# EasyEDA Pro project ProProject_fpga_cpu_2024-09-28.epro, board PCB2
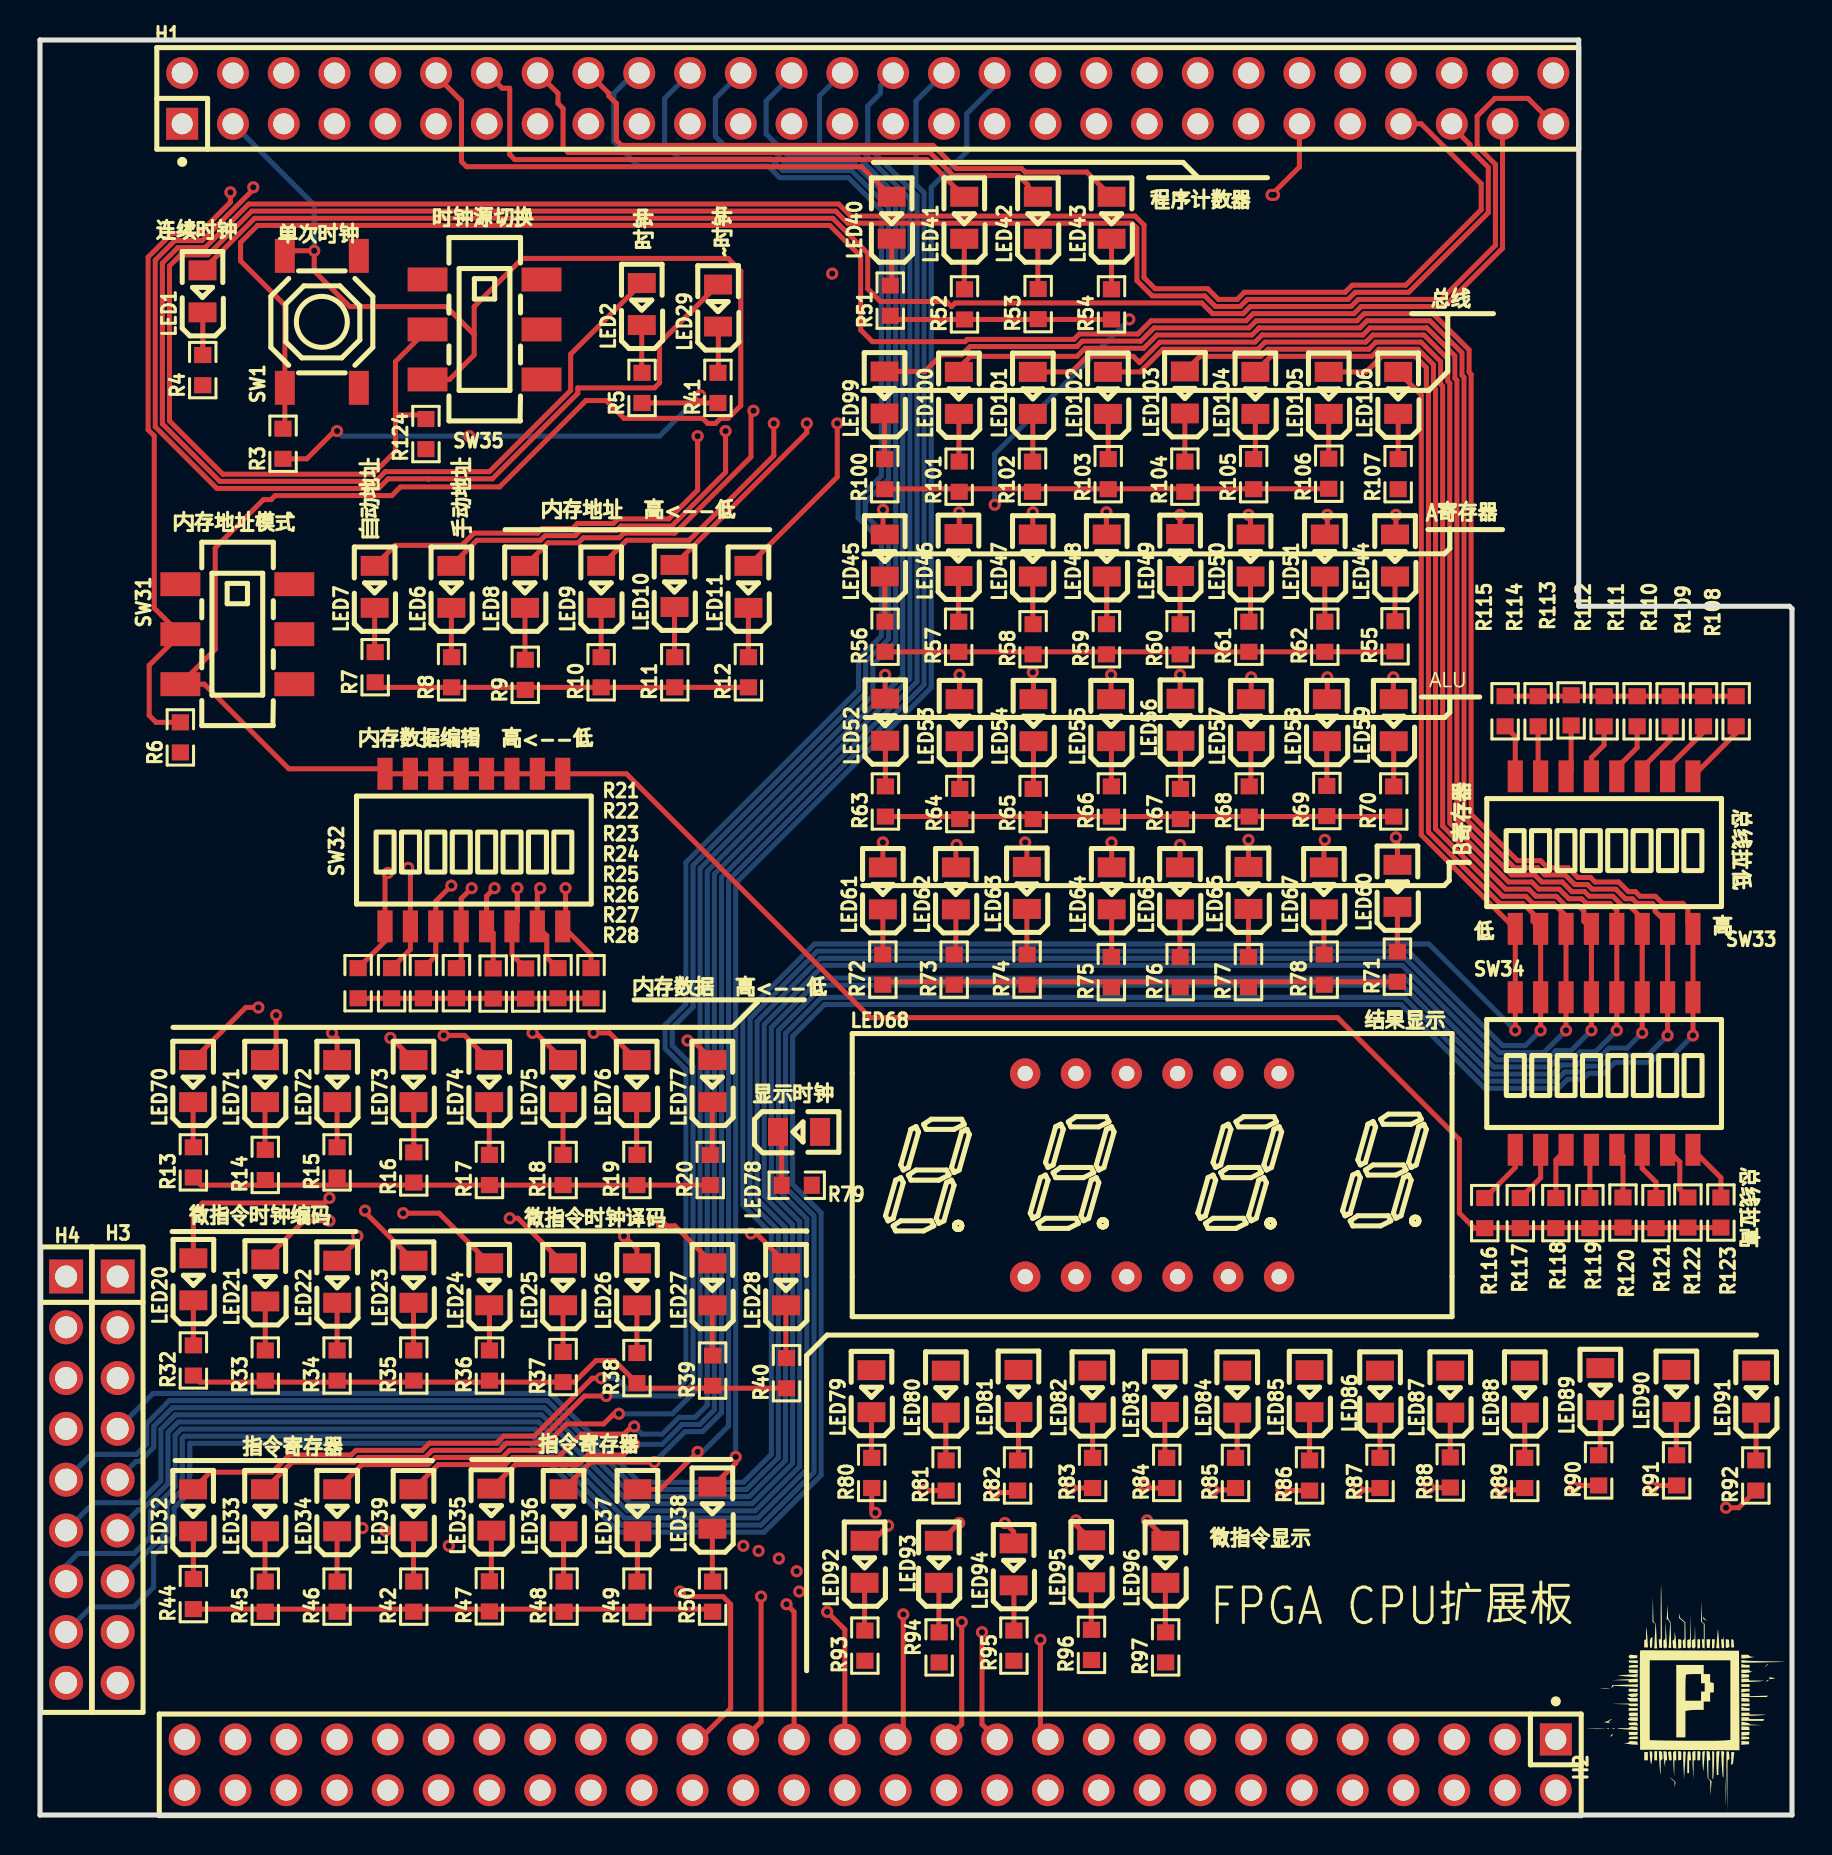
[diagram p5: board, top side]
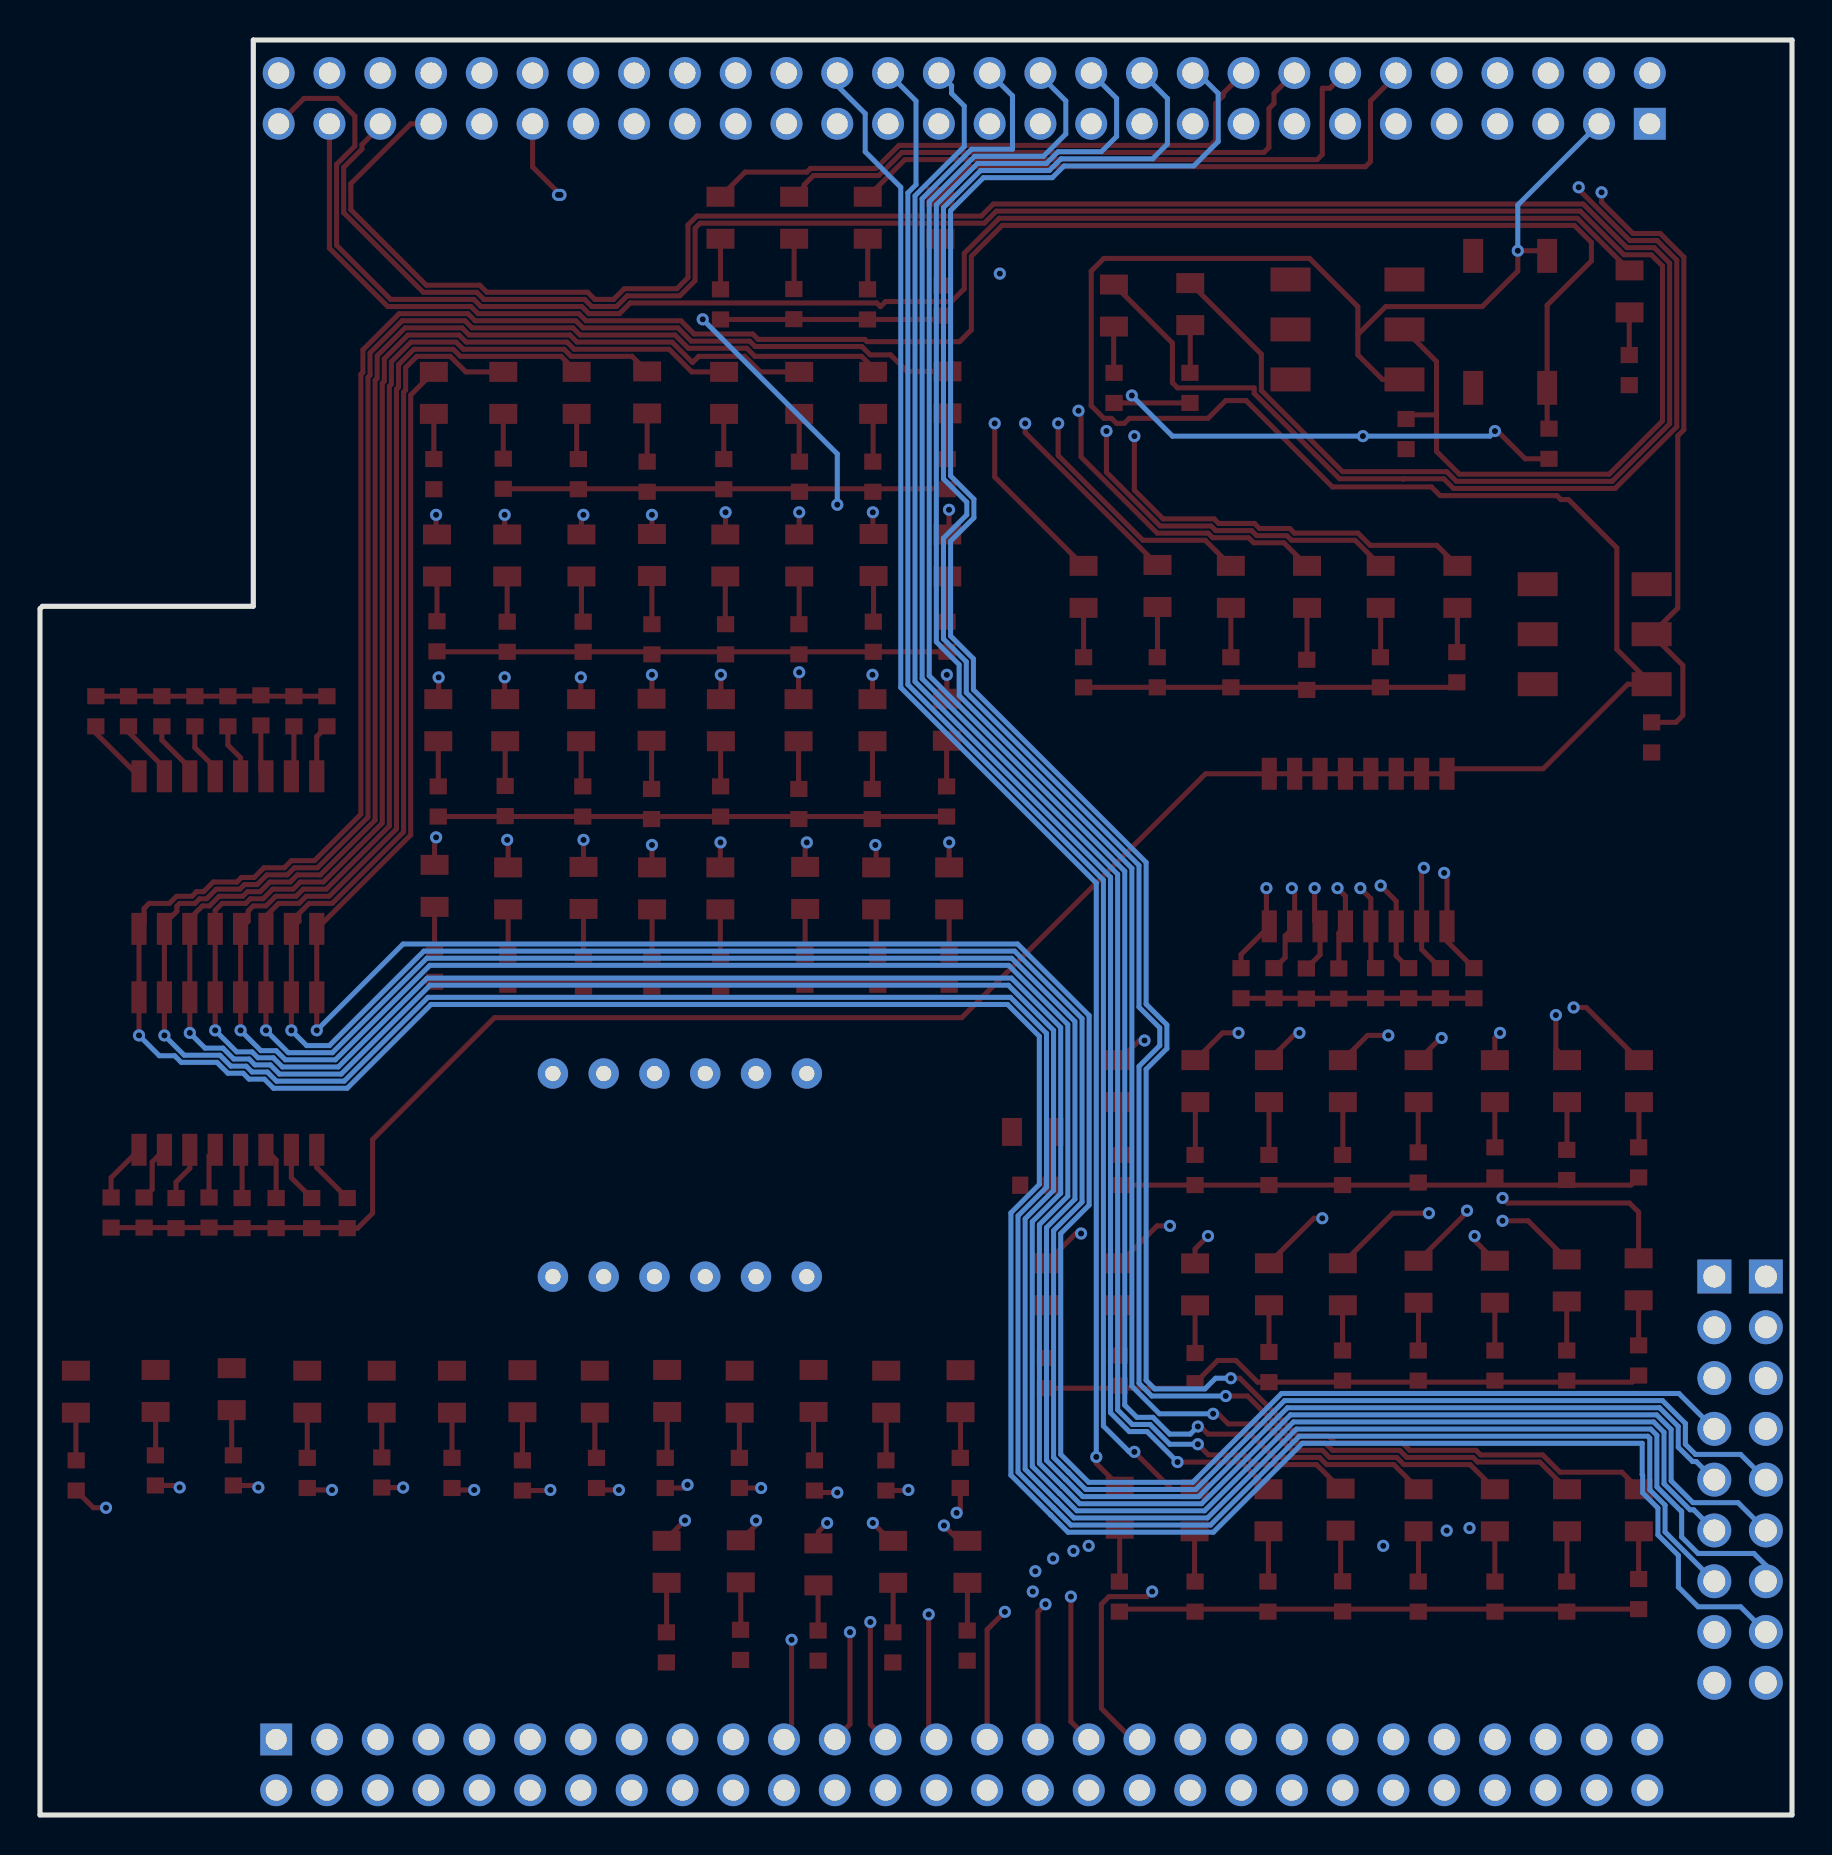
[diagram p6: board, bottom side, seen from below]

Outline 87.63 x 88.77 mm; copper layers: Top Layer, Inner1, Inner2, Bottom Layer. Coordinates in mm from the lower left corner of the outline.
Outline path: 0,88.77 76.96,88.77 76.96,60.45 87.5,60.45 87.63,60.33 87.63,0 0,0 0,88.77
Stack: Top Layer 0.035mm 外层铜厚1oz / Dielectric1 0.2104mm 7628 RC49% 8.6mil / Inner1 0.0152mm 内层铜厚 / Dielectric2 1.065mm 1.1mm H/HOZ 含铜 / Inner2 0.0152mm 内层铜厚 / Dielectric3 0.2104mm 7628 RC49% 8.6mil / Bottom Layer 0.035mm 外层铜厚1oz

## Design rules (mm)
template: JLCPCB Capability(Two Layers Board)
spacing copperThickness1oz (default): track to track 0.102, other pairs 0.152 to 0.3
spacing copperThickness2oz: track to track 0.203, other pairs 0.152 to 0.3
track width copperThickness1oz (default): min 0.127, default 0.254, max 2.54
track width copperThickness2oz: min 0.203, default 0.254, max 2.54
differential pair differentialPair (default): width min 0.127, default 0.254, max 2.54; gap min 0.152, default 0.152
via viaSize (default): diameter min 0.5, default 0.61, max 10; hole min 0.3, default 0.305, max 6.3

## Placement (name value [footprint] x y rotation side)
H1  X6521WV-2x28H-C60D30  [HDR-TH_56P-2.54-V-M-R2-C28-S2.54]  41.4 85.85 0 top
H2  X6521WV-2x28H-C60D30  [HDR-TH_56P-2.54-V-M-R2-C28-S2.54]  41.53 2.51 180 top
H3  -  [HDR-TH_9P-P2.54-V-M]  3.88 16.77 270 top
H4  -  [HDR-TH_9P-P2.54-V-M]  1.31 16.77 270 top
LED1  KT-0805Y  [LED0805-R-RD]  8.13 76.2 90 top
LED2  KT-0805Y  [LED0805-R-RD]  30.1 75.57 90 top
LED6  KT-0805Y  [LED0805-R-RD]  20.57 61.42 90 top
LED7  KT-0805G  [LED0805-R-RD]  16.74 61.42 90 top
LED8  KT-0805Y  [LED0805-R-RD]  24.26 61.42 90 top
LED9  KT-0805Y  [LED0805-R-RD]  28.07 61.42 90 top
LED10  KT-0805Y  [LED0805-R-RD]  31.74 61.47 90 top
LED11  KT-0805Y  [LED0805-R-RD]  35.43 61.42 90 top
LED20  KT-0805Y  [LED0805-R-RD]  7.67 26.79 90 top
LED21  KT-0805Y  [LED0805-R-RD]  11.27 26.73 90 top
LED22  KT-0805Y  [LED0805-R-RD]  14.86 26.67 90 top
LED23  KT-0805G  [LED0805-R-RD]  18.68 26.67 90 top
LED24  KT-0805G  [LED0805-R-RD]  22.47 26.54 90 top
LED25  KT-0805G  [LED0805-R-RD]  26.16 26.54 90 top
LED26  KT-0805G  [LED0805-R-RD]  29.86 26.54 90 top
LED27  KT-0805G  [LED0805-R-RD]  33.63 26.54 90 top
LED28  KT-0805G  [LED0805-R-RD]  37.31 26.54 90 top
LED29  KT-0805Y  [LED0805-R-RD]  33.91 75.49 90 top
LED32  KT-0805G  [LED0805-R-RD]  7.66 15.24 90 top
LED33  KT-0805G  [LED0805-R-RD]  11.25 15.24 90 top
LED34  KT-0805G  [LED0805-R-RD]  14.86 15.24 90 top
LED35  KT-0805Y  [LED0805-R-RD]  22.58 15.27 90 top
LED36  KT-0805Y  [LED0805-R-RD]  26.19 15.24 90 top
LED37  KT-0805Y  [LED0805-R-RD]  29.88 15.24 90 top
LED38  KT-0805Y  [LED0805-R-RD]  33.63 15.37 90 top
LED39  KT-0805G  [LED0805-R-RD]  18.68 15.24 90 top
LED40  KT-0805G  [LED0805-R-RD]  42.6 79.88 90 top
LED41  KT-0805G  [LED0805-R-RD]  46.23 79.88 90 top
LED42  KT-0805G  [LED0805-R-RD]  49.91 79.88 90 top
LED43  KT-0805G  [LED0805-R-RD]  53.59 79.88 90 top
LED44  KT-0805W  [LED0805-R-RD]  67.77 62.99 90 top
LED45  KT-0805W  [LED0805-R-RD]  42.25 62.99 90 top
LED46  KT-0805W  [LED0805-R-RD]  45.94 63.02 90 top
LED47  KT-0805W  [LED0805-R-RD]  49.66 62.99 90 top
LED48  KT-0805W  [LED0805-R-RD]  53.35 62.99 90 top
LED49  KT-0805W  [LED0805-R-RD]  57.02 63.02 90 top
LED50  KT-0805W  [LED0805-R-RD]  60.55 62.99 90 top
LED51  KT-0805W  [LED0805-R-RD]  64.26 62.99 90 top
LED52  KT-0805G  [LED0805-R-RD]  42.27 54.78 90 top
LED53  KT-0805G  [LED0805-R-RD]  45.99 54.75 90 top
LED54  KT-0805G  [LED0805-R-RD]  49.69 54.75 90 top
LED55  KT-0805G  [LED0805-R-RD]  53.57 54.75 90 top
LED56  KT-0805G  [LED0805-R-RD]  57.04 54.78 90 top
LED57  KT-0805G  [LED0805-R-RD]  60.57 54.75 90 top
LED58  KT-0805G  [LED0805-R-RD]  64.36 54.75 90 top
LED59  KT-0805G  [LED0805-R-RD]  67.71 54.75 90 top
LED60  KT-0805W  [LED0805-R-RD]  67.89 46.47 90 top
LED61  KT-0805W  [LED0805-R-RD]  42.16 46.34 90 top
LED62  KT-0805W  [LED0805-R-RD]  45.81 46.34 90 top
LED63  KT-0805W  [LED0805-R-RD]  49.36 46.37 90 top
LED64  KT-0805W  [LED0805-R-RD]  53.6 46.34 90 top
LED65  KT-0805W  [LED0805-R-RD]  57.02 46.34 90 top
LED66  KT-0805W  [LED0805-R-RD]  60.44 46.37 90 top
LED67  KT-0805W  [LED0805-R-RD]  64.22 46.34 90 top
LED68  FJ3461AH  [LED-SEG-TH_12P-L30.0-W14.0-P2.54-S10.16-BL]  55.63 32 0 top
LED70  NCD0805R1  [LED0805-R-RD]  7.66 36.7 90 top
LED71  NCD0805R1  [LED0805-R-RD]  11.25 36.7 90 top
LED72  NCD0805R1  [LED0805-R-RD]  14.86 36.7 90 top
LED73  NCD0805R1  [LED0805-R-RD]  18.68 36.7 90 top
LED74  NCD0805R1  [LED0805-R-RD]  22.47 36.7 90 top
LED75  NCD0805R1  [LED0805-R-RD]  26.16 36.7 90 top
LED76  NCD0805R1  [LED0805-R-RD]  29.84 36.7 90 top
LED77  NCD0805R1  [LED0805-R-RD]  33.63 36.7 90 top
LED78  NCD0805R1  [LED0805-R-RD]  37.96 34.16 0 top
LED79  KT-0805G  [LED0805-R-RD]  41.59 21.2 90 top
LED80  KT-0805G  [LED0805-R-RD]  45.31 21.17 90 top
LED81  KT-0805G  [LED0805-R-RD]  48.94 21.21 90 top
LED82  KT-0805G  [LED0805-R-RD]  52.63 21.17 90 top
LED83  KT-0805G  [LED0805-R-RD]  56.26 21.21 90 top
LED84  KT-0805G  [LED0805-R-RD]  59.88 21.17 90 top
LED85  KT-0805G  [LED0805-R-RD]  63.5 21.2 90 top
LED86  KT-0805G  [LED0805-R-RD]  67.02 21.17 90 top
LED87  KT-0805G  [LED0805-R-RD]  70.54 21.17 90 top
LED88  KT-0805G  [LED0805-R-RD]  74.26 21.17 90 top
LED89  KT-0805G  [LED0805-R-RD]  78.04 21.3 90 top
LED90  KT-0805G  [LED0805-R-RD]  81.84 21.21 90 top
LED91  KT-0805G  [LED0805-R-RD]  85.83 21.17 90 top
LED92  KT-0805G  [LED0805-R-RD]  41.24 12.66 90 top
LED93  KT-0805G  [LED0805-R-RD]  44.96 12.66 90 top
LED94  KT-0805G  [LED0805-R-RD]  48.7 12.54 90 top
LED95  KT-0805G  [LED0805-R-RD]  52.58 12.69 90 top
LED96  KT-0805G  [LED0805-R-RD]  56.29 12.66 90 top
LED99  KT-0805Y  [LED0805-R-RD]  42.24 71.15 90 top
LED100  KT-0805Y  [LED0805-R-RD]  45.96 71.12 90 top
LED101  KT-0805Y  [LED0805-R-RD]  49.66 71.12 90 top
LED102  KT-0805Y  [LED0805-R-RD]  53.41 71.12 90 top
LED103  KT-0805Y  [LED0805-R-RD]  57.26 71.15 90 top
LED104  KT-0805Y  [LED0805-R-RD]  60.79 71.12 90 top
LED105  KT-0805Y  [LED0805-R-RD]  64.46 71.12 90 top
LED106  KT-0805Y  [LED0805-R-RD]  67.93 71.12 90 top
R3  1kΩ  [R0603]  12.16 68.58 90 top
R4  330Ω  [R0603]  8.14 72.26 90 top
R5  330Ω  [R0603]  30.11 71.37 90 top
R6  1kΩ  [R0603]  7.02 53.89 90 top
R7  330Ω  [R0603]  16.76 57.4 90 top
R8  330Ω  [R0603]  20.59 57.15 90 top
R9  330Ω  [R0603]  24.27 57.02 90 top
R10  330Ω  [R0603]  28.07 57.15 90 top
R11  330Ω  [R0603]  31.75 57.15 90 top
R12  330Ω  [R0603]  35.43 57.15 90 top
R13  330Ω  [R0603]  7.67 32.64 90 top
R14  330Ω  [R0603]  11.27 32.51 90 top
R15  330Ω  [R0603]  14.86 32.64 90 top
R16  330Ω  [R0603]  18.7 32.39 90 top
R17  330Ω  [R0603]  22.48 32.26 90 top
R18  330Ω  [R0603]  26.16 32.26 90 top
R19  330Ω  [R0603]  29.86 32.26 90 top
R20  330Ω  [R0603]  33.52 32.26 90 top
R21  1kΩ  [R0603]  15.91 41.6 90 top
R22  1kΩ  [R0603]  17.59 41.6 90 top
R23  1kΩ  [R0603]  19.18 41.6 90 top
R24  1kΩ  [R0603]  20.83 41.6 90 top
R25  1kΩ  [R0603]  22.67 41.58 90 top
R26  1kΩ  [R0603]  24.29 41.58 90 top
R27  1kΩ  [R0603]  25.91 41.6 90 top
R28  1kΩ  [R0603]  27.56 41.6 90 top
R32  330Ω  [R0603]  7.67 22.73 90 top
R33  330Ω  [R0603]  11.27 22.48 90 top
R34  330Ω  [R0603]  14.86 22.48 90 top
R35  330Ω  [R0603]  18.7 22.48 90 top
R36  330Ω  [R0603]  22.48 22.48 90 top
R37  330Ω  [R0603]  26.16 22.4 90 top
R38  330Ω  [R0603]  29.86 22.35 90 top
R39  330Ω  [R0603]  33.64 22.23 90 top
R40  330Ω  [R0603]  37.34 22.1 90 top
R41  330Ω  [R0603]  33.91 71.37 90 top
R42  330Ω  [R0603]  18.7 10.92 90 top
R44  330Ω  [R0603]  7.67 11.05 90 top
R45  330Ω  [R0603]  11.27 10.92 90 top
R46  330Ω  [R0603]  14.86 10.92 90 top
R47  330Ω  [R0603]  22.48 10.94 90 top
R48  330Ω  [R0603]  26.21 10.92 90 top
R49  330Ω  [R0603]  29.86 10.92 90 top
R50  330Ω  [R0603]  33.64 10.92 90 top
R51  330Ω  [R0603]  42.53 75.74 90 top
R52  330Ω  [R0603]  46.24 75.55 90 top
R53  330Ω  [R0603]  49.92 75.57 90 top
R54  330Ω  [R0603]  53.59 75.55 90 top
R55  330Ω  [R0603]  67.77 58.95 90 top
R56  330Ω  [R0603]  42.27 58.93 90 top
R57  330Ω  [R0603]  45.95 58.93 90 top
R58  330Ω  [R0603]  49.67 58.8 90 top
R59  330Ω  [R0603]  53.34 58.8 90 top
R60  330Ω  [R0603]  57.02 58.8 90 top
R61  330Ω  [R0603]  60.46 58.93 90 top
R62  330Ω  [R0603]  64.26 58.93 90 top
R63  330Ω  [R0603]  42.28 50.69 90 top
R64  330Ω  [R0603]  46.01 50.56 90 top
R65  330Ω  [R0603]  49.67 50.56 90 top
R66  330Ω  [R0603]  53.59 50.69 90 top
R67  330Ω  [R0603]  57.04 50.56 90 top
R68  330Ω  [R0603]  60.48 50.69 90 top
R69  330Ω  [R0603]  64.36 50.71 90 top
R70  330Ω  [R0603]  67.71 50.69 90 top
R71  330Ω  [R0603]  67.89 42.43 90 top
R72  330Ω  [R0603]  42.16 42.28 90 top
R73  330Ω  [R0603]  45.72 42.28 90 top
R74  330Ω  [R0603]  49.37 42.28 90 top
R75  330Ω  [R0603]  53.59 42.15 90 top
R76  330Ω  [R0603]  57.03 42.15 90 top
R77  330Ω  [R0603]  60.44 42.15 90 top
R78  330Ω  [R0603]  64.23 42.28 90 top
R79  330Ω  [R0603]  37.85 31.5 180 top
R80  330Ω  [R0603]  41.6 17.11 90 top
R81  330Ω  [R0603]  45.32 16.98 90 top
R82  330Ω  [R0603]  48.89 16.98 90 top
R83  330Ω  [R0603]  52.65 17.11 90 top
R84  330Ω  [R0603]  56.36 17.11 90 top
R85  330Ω  [R0603]  59.8 17.11 90 top
R86  330Ω  [R0603]  63.5 16.98 90 top
R87  330Ω  [R0603]  67.02 17.11 90 top
R88  330Ω  [R0603]  70.54 17.13 90 top
R89  330Ω  [R0603]  74.26 17.11 90 top
R90  330Ω  [R0603]  77.96 17.24 90 top
R91  330Ω  [R0603]  81.86 17.24 90 top
R92  330Ω  [R0603]  85.82 16.98 90 top
R93  330Ω  [R0603]  41.26 8.47 90 top
R94  330Ω  [R0603]  44.97 8.38 90 top
R95  330Ω  [R0603]  48.71 8.47 90 top
R96  330Ω  [R0603]  52.59 8.51 90 top
R97  330Ω  [R0603]  56.3 8.38 90 top
R100  330Ω  [R0603]  42.25 67.06 90 top
R101  330Ω  [R0603]  45.97 66.93 90 top
R102  330Ω  [R0603]  49.64 66.93 90 top
R103  330Ω  [R0603]  53.43 67.06 90 top
R104  330Ω  [R0603]  57.26 66.93 90 top
R105  330Ω  [R0603]  60.7 67.06 90 top
R106  330Ω  [R0603]  64.46 67.08 90 top
R107  330Ω  [R0603]  67.93 67.06 90 top
R108  1kΩ  [R0603]  84.84 55.2 270 top
R109  1kΩ  [R0603]  83.2 55.2 270 top
R110  1kΩ  [R0603]  81.53 55.2 270 top
R111  1kΩ  [R0603]  79.88 55.2 270 top
R112  1kΩ  [R0603]  78.23 55.2 270 top
R113  1kΩ  [R0603]  76.58 55.25 270 top
R114  1kΩ  [R0603]  74.93 55.2 270 top
R115  1kΩ  [R0603]  73.28 55.2 270 top
R116  1kΩ  [R0603]  72.26 30.1 90 top
R117  1kΩ  [R0603]  74.04 30.1 90 top
R118  1kΩ  [R0603]  75.82 30.1 90 top
R119  1kΩ  [R0603]  77.52 30.1 90 top
R120  1kΩ  [R0603]  79.17 30.13 90 top
R121  1kΩ  [R0603]  80.83 30.1 90 top
R122  1kΩ  [R0603]  82.42 30.13 90 top
R123  1kΩ  [R0603]  84.07 30.13 90 top
R124  1kΩ  [R0603]  19.3 69.06 90 top
SW1  TS-1187A-B-A-B  [SW-SMD_4P-L5.1-W5.1-P3.70-LS6.5-TL-2]  14.1 74.68 90 top
SW31  MST22D18G2  [SW-SMD_MST22D18G2]  9.87 59.06 270 top
SW32  DSHP08TSGER  [SW-SMD_16P-L11.7-W5.4-P1.27-LS8.5]  21.7 48.26 0 top
SW33  DSHP08TSGER  [SW-SMD_16P-L11.7-W5.4-P1.27-LS8.5]  78.23 48.13 180 top
SW34  DSHP08TSGER  [SW-SMD_16P-L11.7-W5.4-P1.27-LS8.5]  78.23 37.08 0 top
SW35  MST22D18G2  [SW-SMD_MST22D18G2]  22.23 74.3 270 top

## Footprints (pads in the part's own frame, mm; a bottom-side part is the same pattern mirrored in y, then rotated)
HDR-TH_9P-P2.54-V-M
  rect 1.7x1.7 hole 1.1: 1(-10.16,0)
  round 1.7 hole 1.1: 2(-7.62,0) 3(-5.08,0) 4(-2.54,0) 5(0,0) 6(2.54,0) 7(5.08,0) 8(7.62,0) 9(10.16,0)
HDR-TH_56P-2.54-V-M-R2-C28-S2.54
  rect 1.6x1.6 hole 1.05: 1(-34.29,-1.27)
  round 1.6 hole 1.05: 2(-34.29,1.27) 3(-31.75,-1.27) 4(-31.75,1.27) 5(-29.21,-1.27) 6(-29.21,1.27) 7(-26.67,-1.27) 8(-26.67,1.27) 9(-24.13,-1.27) 10(-24.13,1.27) 11(-21.59,-1.27) 12(-21.59,1.27) 13(-19.05,-1.27) 14(-19.05,1.27) 15(-16.51,-1.27) 16(-16.51,1.27) 17(-13.97,-1.27) 18(-13.97,1.27) 19(-11.43,-1.27) 20(-11.43,1.27) 21(-8.89,-1.27) 22(-8.89,1.27) 23(-6.35,-1.27) 24(-6.35,1.27) 25(-3.81,-1.27) 26(-3.81,1.27) 27(-1.27,-1.27) 28(-1.27,1.27) 29(1.27,-1.27) 30(1.27,1.27) 31(3.81,-1.27) 32(3.81,1.27) 33(6.35,-1.27) 34(6.35,1.27) 35(8.89,-1.27) 36(8.89,1.27) 37(11.43,-1.27) 38(11.43,1.27) 39(13.97,-1.27) 40(13.97,1.27) 41(16.51,-1.27) 42(16.51,1.27) 43(19.05,-1.27) 44(19.05,1.27) 45(21.59,-1.27) 46(21.59,1.27) 47(24.13,-1.27) 48(24.13,1.27) 49(26.67,-1.27) 50(26.67,1.27) 51(29.21,-1.27) 52(29.21,1.27) 53(31.75,-1.27) 54(31.75,1.27) 55(34.29,-1.27) 56(34.29,1.27)
LED0805-R-RD
  rect 1x1.399 smd: 1(1.05,0) 2(-1.05,0)
LED-SEG-TH_12P-L30.0-W14.0-P2.54-S10.16-BL
  round 1.524 hole 0.762: 1(-6.35,-5.08) 2(-3.81,-5.08) 3(-1.27,-5.08) 4(1.27,-5.08) 5(3.81,-5.08) 6(6.35,-5.08) 7(6.35,5.08) 8(3.81,5.08) 9(1.27,5.08) 10(-1.27,5.08) 11(-3.81,5.08) 12(-6.35,5.08)
R0603
  rect 0.806x0.864 smd: 1(-0.753,0) 2(0.753,0)
SW-SMD_4P-L5.1-W5.1-P3.70-LS6.5-TL-2
  rect 1.7x1 smd: 1(-3.3,1.85) 2(3.3,1.85) 3(-3.3,-1.85) 4(3.3,-1.85)
SW-SMD_16P-L11.7-W5.4-P1.27-LS8.5
  rect 0.76x1.6 smd: 1(-4.445,-3.815) 2(-3.175,-3.815) 3(-1.905,-3.815) 4(-0.635,-3.815) 5(0.635,-3.815) 6(1.905,-3.815) 7(3.175,-3.815) 8(4.445,-3.815) 9(-4.445,3.815) 10(-3.175,3.815) 11(-1.905,3.815) 12(-0.635,3.815) 13(0.635,3.815) 14(1.905,3.815) 15(3.175,3.815) 16(4.445,3.815)
SW-SMD_MST22D18G2
  rect 1.2x2 smd: 1(-2.5,2.85) 2(0,2.85) 3(2.5,2.85) 4(-2.5,-2.85) 5(0,-2.85) 6(2.5,-2.85)

## Nets
As in the schematic.

Pads without a net: H3 1 2 3 8 9; H4 1 2 3 4 9; SW1 3 4; SW31 1 2 3 4; SW35 1 2 3 4

## Via types
v1: diameter 0.61, hole 0.305, Top Layer to Bottom Layer, 116 vias

## Routing (per net, layer and track width the routed paths; a pad name or vN(x,y) marks a point on that pad's centre or on a via; arc(x,y) is an arc through that point)
+3.3V: length 174.7
  Top Layer w0.254: 21.72,74.04 21.72,75.44 24.13,77.85 34.42,77.85 35.05,77.22 35.05,70.49 34.42,69.85 34.04,69.85 33.78,69.6 33.4,69.6 33.15,69.85 29.21,69.85 28.32,70.74 27.31,70.74 22.99,66.42 18.03,66.42 17.6,65.99 11.76,65.99 11.56,65.79 11.18,65.79 8.76,63.37 8.76,58.3 SW31.6 8.21,56.56 12.45,52.32 17.01,52.32 SW32.9 SW32.10 SW32.11 SW32.12 SW32.13 SW32.14 SW32.15 SW32.16 29.33,52.08 41.53,39.88 64.9,39.88 70.99,33.78 70.99,30.1 71.74,29.35 R116.1 72.29,29.38 R120.1 R122.1 R123.1 ; 21.72,74.04 20.32,75.44 15.49,75.44 13.72,77.22 v1(13.72,78.23) 12.5,78.23 SW1.2 ; 21.72,74.04 21.72,73.03 20.49,71.8 SW35.6
  Bottom Layer w0.254: v1(13.72,78.23) 13.72,80.52 H1.3
GND: length 342.8
  Top Layer w0.254: R106.1 42.28,66.33 R100.1 ; v1(80.64,16.38) 80.74,16.48 R91.1 ; 33.93,70.49 33.8,70.62 R5.1 ; R28.1 R27.1 R24.1 R23.1 R22.1 R21.1 ; R3.1 13.34,67.83 14.73,69.22 v1(14.86,69.22) ; R20.1 R19.1 R18.1 R17.1 8.05,31.5 R13.1 ; v1(62.1,16.26) 62.13,16.23 R86.1 ; v1(76.71,16.38) 76.81,16.48 R90.1 ; 42.16,41.53 42.31,41.67 R71.1 ; R88.1 v1(69.47,16.38) ; R7.1 17.02,56.4 R8.1 R10.1 R11.1 R12.1 ; R87.1 66.92,16.26 v1(65.91,16.26) ; v1(41.78,15.11) 41.6,15.3 R80.1 ; v1(84.33,15.37) 84.96,15.37 R92.1 ; 53.59,74.8 42.71,74.8 R51.1 ; v1(47.75,16.13) 48.8,16.13 R82.1 ; R115.1 R114.1 R112.1 R111.1 R110.1 R109.1 R108.1 ; v1(58.67,16.26) 59.7,16.26 R85.1 ; v1(73.03,16.26) 74.16,16.26 R89.1 ; R56.1 R57.1 R61.1 R62.1 67.75,58.17 R55.1 ; R83.1 v1(51.56,16.36) ; R81.1 44.22,16.23 v1(44.2,16.26) ; v1(55.25,16.51) 55.4,16.36 R84.1 ; R63.1 R66.1 R68.1 R70.1 ; R32.1 8,21.65 R37.1 26.73,21.65 27.81,22.73 28.72,22.73 R38.1 30.11,21.34 R40.1 ; R44.1 33.52,10.3 R50.1
  Inner1 w0.254: v1(41.78,15.11) 42.04,15.37 47.78,15.37 ; 47.78,15.37 51.56,15.37 ; 47.78,15.37 47.75,15.39 v1(47.75,16.13) ; 51.56,15.37 55.25,15.37 ; 51.56,15.37 v1(51.56,16.36) ; 55.25,15.37 55.25,15.37 v1(55.25,16.51) ; 55.25,15.37 58.66,15.37 ; 80.55,15.37 80.64,15.46 v1(80.64,16.38) ; 80.55,15.37 v1(84.33,15.37) ; 80.55,15.37 76.71,15.37 ; v1(58.67,16.26) 58.67,15.38 58.66,15.37 ; v1(44.2,16.26) 44.2,15.37 ; 58.66,15.37 62.1,15.37 ; v1(73.03,16.26) 73.03,15.37 73.02,15.37 ; v1(76.71,16.38) 76.71,15.37 ; 76.71,15.37 73.02,15.37 ; v1(65.91,16.26) 65.79,16.13 65.79,15.37 ; 65.79,15.37 69.41,15.37 ; 65.79,15.37 62.1,15.37 ; 73.02,15.37 69.41,15.37 ; v1(69.47,16.38) 69.47,15.42 69.41,15.37 ; 62.1,15.37 v1(62.1,16.26)
  Bottom Layer w0.254: v1(47.75,65.53) 47.75,68.07 v1(54.48,74.8) ; v1(14.86,69.22) 15.11,68.96 v1(21.46,68.96) 30.99,68.96 v1(33.02,70.99)
AA8: length 189.1
  Top Layer w0.254: LED51.1 64.39,64.17 v1(64.39,65.02)
  Inner1 w0.254: 28.2,7.72 8.5,7.72 7.22,9.01 7.22,28.83 5.84,30.2 5.08,30.2 2.56,32.72 2.56,64.44 4.21,66.09 37.07,66.09 37.09,66.06 37.85,66.06 41.17,62.74 46.08,62.74 46.43,63.09 49.61,63.09 49.97,63.45 53.15,63.45 53.25,63.55 53.76,63.55 54.12,63.91 59.84,63.91 60.19,64.26 60.58,64.26 61.34,65.02 v1(64.39,65.02) ; 28.2,7.72 57.92,7.72 59.35,6.3 64.06,6.3 64.89,5.46 66.52,5.46 H2.7 ; 28.2,7.72 30.48,7.72
AA18: length 167.2
  Top Layer w0.254: LED60.1 67.89,48.82 v1(67.82,48.9)
  Inner1 w0.254: v1(67.82,48.9) 67.82,54.86 66.67,56.01 42.16,56.01 40.26,57.91 40.26,59.18 39.7,59.18 36.37,62.5 35.62,62.5 35.59,62.53 6.33,62.53 6.33,34.04 6.6,33.76 7.31,33.76 10.78,30.3 10.78,11.28 31.1,11.28 31.57,11.76 37.39,11.76 v1(37.97,11.18)
  Inner2 w0.254: H2.37 31.52,5.21 35.94,5.21 37.97,7.24 v1(37.97,11.18)
AB6: length 181.5
  Top Layer w0.254: LED50.1 60.55,64.93 v1(60.45,65.02)
  Inner1 w0.254: H2.9 65.15,4.29 65.15,4.7 63.91,5.94 59.2,5.94 57.77,7.37 8.35,7.37 6.86,8.86 6.86,28.68 5.69,29.85 4.93,29.85 2.21,32.57 2.21,64.59 4.06,66.44 37.22,66.44 37.24,66.42 37.99,66.42 41.32,63.09 45.93,63.09 46.28,63.45 49.46,63.45 49.82,63.8 53,63.8 53.1,63.91 53.61,63.91 53.97,64.26 59.69,64.26 v1(60.45,65.02)
AB7: length 176.2
  Top Layer w0.254: LED49.1 v1(57.02,65.02)
  Inner1 w0.254: v1(57.02,65.02) 54.23,65.02 53.47,64.26 52.95,64.26 52.85,64.16 49.67,64.16 49.32,63.8 46.14,63.8 45.78,63.45 41.47,63.45 38.14,66.78 37.39,66.78 37.36,66.8 3.92,66.8 1.85,64.73 1.85,32.42 4.78,29.49 5.54,29.49 6.5,28.53 6.5,8.72 8.21,7.01 57.63,7.01 59.05,5.59 61.6,5.59 63.12,4.07 H2.11
ALU_0: length 175.8
  Top Layer w0.254: 67.71,55.8 67.69,55.82 v1(67.69,56.9) ; v1(50.04,8.76) 50.04,4.16 H2.21
  Inner1 w0.254: v1(50.04,8.76) 49.71,8.44 8.8,8.44 7.93,9.3 7.93,29.12 6.13,30.92 5.37,30.92 3.27,33.01 3.27,64.14 4.51,65.38 36.77,65.38 36.8,65.35 37.55,65.35 40.88,62.02 46.37,62.02 46.73,62.38 49.91,62.38 50.26,62.74 53.44,62.74 53.54,62.84 54.06,62.84 54.41,63.19 60.13,63.19 60.49,63.55 60.87,63.55 60.95,63.63 v1(67.69,56.9)
ALU_1: length 168.5
  Top Layer w0.254: v1(64.39,56.9) 64.39,55.83 64.36,55.8 ; v1(47.12,9.14) 47.12,4.54 H2.23
  Inner1 w0.254: v1(47.12,9.14) 46.76,8.79 8.94,8.79 8.28,9.45 8.28,29.27 6.28,31.27 5.52,31.27 3.63,33.16 3.63,63.99 4.65,65.02 36.63,65.02 36.65,65 37.4,65 40.73,61.67 46.52,61.67 46.87,62.02 50.05,62.02 50.41,62.38 53.59,62.38 53.69,62.48 54.2,62.48 54.56,62.84 58.45,62.84 v1(64.39,56.9)
ALU_2: length 164.8
  Top Layer w0.254: v1(60.58,56.9) 60.58,55.82 60.57,55.8 ; v1(46.1,9.65) 46.1,4.55 H2.25
  Inner1 w0.254: v1(60.58,56.9) 60.58,60.2 58.3,62.48 54.71,62.48 54.35,62.13 53.84,62.13 53.74,62.02 50.56,62.02 50.2,61.67 47.02,61.67 46.67,61.31 40.58,61.31 37.26,64.64 36.5,64.64 36.48,64.66 4.8,64.66 3.98,63.85 3.98,33.31 5.67,31.63 6.43,31.63 8.64,29.41 8.64,9.6 9.09,9.15 45.47,9.15 45.97,9.65 v1(46.1,9.65)
ALU_3: length 156.8
  Top Layer w0.254: v1(43.18,10.03) 43.18,4.16 H2.27 ; v1(57.02,57.02) 57.02,55.85 LED56.1
  Inner1 w0.254: v1(43.18,10.03) 43.05,10.03 42.52,9.5 9.24,9.5 9,9.74 9,29.56 6.57,31.98 5.81,31.98 4.34,33.46 4.34,63.7 4.95,64.31 36.33,64.31 36.36,64.28 37.11,64.28 40.44,60.96 46.81,60.96 47.17,61.31 50.35,61.31 50.7,61.67 53.88,61.67 53.99,61.77 54.5,61.77 54.72,61.99 57.02,59.69 v1(57.02,57.02)
ALU_4: length 148.6
  Top Layer w0.254: H2.29 40.26,9.27 v1(39.37,10.16) ; 53.57,55.8 v1(53.57,57.02)
  Inner1 w0.254: v1(39.37,10.16) 39.07,9.86 9.38,9.86 9.35,9.89 9.35,29.71 6.72,32.34 6.02,32.34 4.69,33.66 4.69,63.44 5.21,63.95 36.18,63.95 36.21,63.93 36.96,63.93 40.29,60.6 46.96,60.6 47.32,60.96 50.5,60.96 50.85,61.31 52.73,61.31 53.57,60.47 v1(53.57,57.02)
ALU_5: length 140.4
  Top Layer w0.254: v1(37.34,10.54) 37.72,10.16 H2.31 ; 49.69,55.8 49.69,57.12 v1(49.66,57.15)
  Inner1 w0.254: v1(37.34,10.54) 37.01,10.22 9.97,10.22 9.72,10.47 9.72,10.73 9.71,10.74 9.71,29.86 6.87,32.7 6.16,32.7 5.08,33.78 5.08,63.21 5.47,63.6 36.04,63.6 36.06,63.57 36.81,63.57 40.14,60.24 47.11,60.24 47.46,60.6 48.75,60.6 49.66,59.69 v1(49.66,57.15)
ALU_6: length 134.1
  Top Layer w0.254: 45.99,55.8 v1(45.99,57.02) ; v1(36.07,10.92) 36.07,4.67 H2.33
  Inner1 w0.254: v1(45.99,57.02) 45.99,59.55 45.65,59.89 39.99,59.89 36.67,63.22 35.91,63.22 35.89,63.24 5.82,63.24 5.44,62.85 5.44,33.93 6.31,33.05 7.02,33.05 10.06,30 10.06,10.81 10.3,10.57 35.72,10.57 v1(36.07,10.92)
ALU_7: length 127.5
  Top Layer w0.254: v1(32,11.18) 32.26,10.92 34.16,10.92 34.54,10.54 34.54,5.33 32.99,3.78 H2.35 ; LED52.1 v1(42.27,57.02)
  Inner1 w0.254: v1(32,11.18) 31.76,10.93 10.45,10.93 10.42,10.95 10.42,30.15 7.16,33.41 6.46,33.41 5.97,33.89 5.97,62.88 35.74,62.88 35.77,62.86 36.52,62.86 39.85,59.53 41.69,59.53 42.27,58.95 v1(42.27,57.02)
BUS0: length 135.6
  Top Layer w0.254: v1(73.79,39.24) SW34.9 SW33.16 69.09,49.02 69.09,71.02 LED106.1
  Bottom Layer w0.254: v1(73.79,39.24) 69.47,43.56 38.73,43.56 35.15,39.98 35.15,30.51 36.58,29.08 36.58,18.03 35.18,16.64 29.97,16.64 25.53,21.08 5.66,21.08 H3.4
BUS1: length 147.8
  Top Layer w0.254: LED105.1 66.33,72.17 67.11,72.95 68.78,72.95 69.34,72.39 69.34,71.27 69.44,71.16 69.44,49.16 73.02,45.59 74.17,45.59 74.68,45.09 74.68,44.7 SW33.15 SW34.10 v1(75.06,39.24)
  Bottom Layer w0.254: H4.5 2.57,18.03 4.83,18.03 5.33,18.54 5.33,19.58 6.48,20.73 25.38,20.73 29.82,16.28 35.33,16.28 36.19,17.15 36.19,17.15 36.93,17.88 36.93,29.23 35.51,30.65 35.51,39.83 38.88,43.21 68.43,43.21 73.15,38.48 74.29,38.48 v1(75.06,39.24)
BUS2: length 151.8
  Top Layer w0.254: LED104.1 61.57,72.95 66.61,72.95 66.96,73.31 68.93,73.31 69.7,72.54 69.7,71.41 69.8,71.31 69.8,49.31 73.16,45.95 74.32,45.95 74.67,45.59 75.69,45.59 76.33,44.96 SW33.14 SW34.11 v1(76.33,39.24)
  Bottom Layer w0.254: v1(76.33,39.24) 75.21,38.13 73,38.13 68.28,42.85 39.03,42.85 35.87,39.69 35.87,30.8 37.29,29.38 37.29,17.73 36.34,16.79 36.34,16.79 35.47,15.93 29.68,15.93 25.23,20.37 6.62,20.37 5.69,19.44 5.69,18.39 4.97,17.68 4.79,17.68 H3.5
BUS3: length 162.6
  Top Layer w0.254: v1(77.6,39.24) SW34.12 SW33.13 77.22,44.7 77.22,45.21 76.96,45.47 76.32,45.47 75.84,45.95 74.82,45.95 74.46,46.31 73.31,46.31 70.16,49.46 70.16,71.46 70.05,71.56 70.05,72.69 69.07,73.66 66.82,73.66 66.46,73.31 61.42,73.31 61.06,72.95 58.02,72.95 LED103.1
  Bottom Layer w0.254: v1(77.6,39.24) 76.58,38.23 75.81,38.23 75.36,37.77 72.86,37.77 68.13,42.49 39.18,42.49 36.22,39.54 36.22,30.95 37.64,29.53 37.64,17.59 36.49,16.43 36.49,16.43 35.62,15.57 29.53,15.57 25.08,20.01 6.77,20.01 6.05,19.29 6.05,16.71 4.95,15.62 2.7,15.62 H4.6
BUS4: length 166.8
  Top Layer w0.254: v1(78.87,39.24) SW34.13 SW33.12 78.87,45.25 78.52,45.59 77.34,45.59 77.11,45.82 76.47,45.82 75.99,46.31 74.97,46.31 74.61,46.66 73.46,46.66 70.51,49.61 70.51,71.61 70.41,71.71 70.41,72.83 69.22,74.02 66.67,74.02 66.31,73.66 61.27,73.66 60.92,73.31 56.16,73.31 55.03,72.17 LED102.1
  Bottom Layer w0.254: v1(78.87,39.24) 77.79,38.17 77.02,38.17 76.73,37.87 75.96,37.87 75.5,37.41 72.71,37.41 68.27,41.86 39.04,41.86 36.58,39.39 36.58,31.1 38,29.67 38,17.44 36.64,16.08 36.63,16.08 35.77,15.21 29.38,15.21 24.94,19.66 6.92,19.66 6.4,19.14 6.4,16.57 5.1,15.27 4.92,15.27 H3.6
BUS5: length 178.3
  Top Layer w0.254: v1(80.14,39.12) SW34.14 SW33.11 80.14,44.83 79.5,45.47 79.15,45.47 78.67,45.95 77.49,45.95 77.26,46.18 76.62,46.18 76.13,46.66 75.11,46.66 74.76,47.02 73.61,47.02 70.87,49.75 70.87,71.75 70.77,71.86 70.77,72.98 69.37,74.38 66.52,74.38 66.16,74.02 61.12,74.02 60.77,73.66 56.02,73.66 54.99,72.64 54.68,72.95 52.38,72.95 51.6,72.17 LED101.1
  Bottom Layer w0.254: H4.7 1.31,12.48 1.91,13.08 4.7,13.08 5.52,13.9 5.52,15.18 5.58,15.24 5.59,15.24 6.76,16.41 6.76,18.99 7.07,19.3 24.79,19.3 29.23,14.86 35.92,14.86 36.78,15.72 36.78,15.72 38.36,17.29 38.36,29.82 36.93,31.24 36.93,39.24 39.19,41.5 68.12,41.5 72.56,37.06 75.65,37.06 76.11,37.52 76.88,37.52 77.17,37.81 77.94,37.81 78.48,38.35 79.38,38.35 v1(80.14,39.12)
BUS6: length 181.6
  Top Layer w0.254: v1(81.41,38.99) SW34.15 SW33.10 81.41,44.58 80.78,45.2 80.78,45.45 80.64,45.59 79.88,45.59 79.65,45.82 79.3,45.82 78.81,46.31 77.63,46.31 77.4,46.53 76.76,46.53 76.28,47.02 75.26,47.02 74.91,47.37 73.75,47.37 71.22,49.9 71.22,71.9 71.12,72 71.12,73.13 69.52,74.73 66.37,74.73 66.02,74.38 60.98,74.38 60.62,74.02 55.87,74.02 55.2,73.36 52.28,73.36 51.88,72.95 46.54,72.95 45.96,72.38 LED100.1
  Bottom Layer w0.254: v1(81.41,38.99) 80.42,38 78.63,38 78.08,37.45 77.32,37.45 77.02,37.16 76.26,37.16 75.8,36.7 72.41,36.7 68.22,40.89 39.09,40.89 37.29,39.1 37.29,31.39 38.71,29.97 38.71,17.14 36.93,15.37 36.93,15.37 36.06,14.5 29.09,14.5 24.64,18.95 7.21,18.95 7.11,18.85 7.11,16.26 6.35,15.5 6.35,14.16 H3.7
BUS7: length 192.6
  Top Layer w0.254: LED99.1 44.26,72.2 45.09,73.03 46.11,73.03 46.52,73.44 51.86,73.44 52.13,73.71 55.06,73.71 55.72,74.38 60.47,74.38 60.83,74.73 65.87,74.73 66.22,75.09 69.67,75.09 71.48,73.28 71.48,72.15 71.58,72.05 71.58,50.05 73.9,47.73 75.05,47.73 75.41,47.37 76.43,47.37 76.91,46.89 77.55,46.89 77.78,46.66 78.96,46.66 79.44,46.18 79.8,46.18 80.03,45.95 80.8,45.95 81.15,45.59 82.17,45.59 82.42,45.34 82.42,44.57 SW33.9 SW34.16 v1(82.68,38.99)
  Bottom Layer w0.254: v1(82.68,38.99) 81.66,37.97 80.89,37.97 80.56,37.64 78.78,37.64 78.23,37.1 77.47,37.1 77.17,36.8 76.4,36.8 75.95,36.35 72.27,36.35 68.07,40.54 39.24,40.54 37.65,38.95 37.65,31.54 39.07,30.12 39.07,17 37.08,15.01 37.07,15.01 36.21,14.15 28.94,14.15 24.49,18.59 7.49,18.59 7.49,17.02 7.47,17 7.47,16.12 6.71,15.35 6.71,14.01 5.68,12.99 5.68,11.4 4.7,10.41 2.57,10.41 H4.8
CLOCK: length 117.5
  Top Layer w0.254: LED2.1 26.54,73.06 26.54,71.25 22.48,67.18 17.27,67.18 16.78,66.7 9,66.7 6.12,69.58 6.12,77.62 6.89,78.39 8.26,78.39 10.44,80.57 39.94,80.57 40.55,79.97 54.77,79.97 55.22,79.52 55.22,76.89 55.77,76.33 58.41,76.33 58.94,75.8 59.88,75.8 60.24,76.16 65.28,76.16 65.63,76.51 68.31,76.51 72.08,80.28 72.08,81.58 69.09,84.58 H1.49
CLOCK_MODE_SELECT: length 106.8
  Top Layer w0.254: 17.78,70.02 19.1,70.02 R124.2 ; 17.78,70.02 17.78,72.69 SW35.5 ; 17.78,70.02 17.78,68.2 16.64,67.06 9.14,67.06 6.48,69.72 6.48,77.47 7.04,78.03 8.4,78.03 10.59,80.21 39.8,80.21 40.4,79.61 54.61,79.61 54.86,79.36 54.86,76.74 55.63,75.98 58.26,75.98 58.79,75.44 60.03,75.44 60.38,75.8 65.43,75.8 65.78,76.15 68.46,76.15 72.44,80.14 72.44,82.4 71.53,83.32 71.53,83.54 70.61,84.46 H1.51
COMMAND_0: length 121.4
  Top Layer w0.254: v1(35.56,29.08) 35.82,29.08 LED28.1
  Inner2 w0.254: v1(35.56,29.08) 34.04,30.61 28.57,30.61 27.85,31.32 23.28,31.32 20.87,33.73 22.37,35.23 33.42,35.23 35.64,37.45 35.64,42.94 32.26,46.32 32.26,49.46 31.98,49.74 31.98,78.58 43.49,78.58 45.08,80.16 50.68,80.16 52.4,81.89 65.37,81.89 66.67,83.19 68.96,83.19 69.22,83.44 69.22,85.09 69.98,85.85 69.98,86.49 H1.52
COMMAND_1: length 116.2
  Top Layer w0.254: LED27.1 31.76,29.46 v1(31.11,29.46)
  Inner2 w0.254: v1(31.11,29.46) 30.35,30.23 28.44,30.23 27.71,30.96 23.13,30.96 20.37,33.73 22.22,35.58 33.27,35.58 35.28,37.6 35.28,42.8 31.91,46.17 31.91,49.31 31.63,49.59 31.63,78.93 43.34,78.93 44.93,80.52 50.53,80.52 52.25,82.24 65.23,82.24 66.67,83.69 66.67,85.6 67.18,86.11 67.18,86.23 H1.50
COMMAND_2: length 111.5
  Top Layer w0.254: LED26.1 29.86,28.31 v1(29.21,28.96)
  Inner2 w0.254: H1.48 65.53,87 64.26,85.73 64.26,83.69 63.17,82.6 52.11,82.6 50.38,80.88 44.78,80.88 43.19,79.29 31.27,79.29 31.27,49.44 31.55,49.16 31.55,46.02 34.93,42.65 34.93,37.74 33.12,35.94 22.07,35.94 19.86,33.73 22.99,30.61 27.56,30.61 v1(29.21,28.96)
COMMAND_3: length 107.7
  Top Layer w0.254: v1(23.49,29.85) 23.91,29.85 LED25.1
  Inner2 w0.254: H1.46 61.59,85.73 61.59,83.57 60.98,82.96 51.96,82.96 50.24,81.23 44.63,81.23 43.05,79.65 30.92,79.65 30.92,49.29 31.2,49.01 31.2,45.88 34.57,42.5 34.57,37.89 32.97,36.3 21.93,36.3 18.52,32.89 18.52,32.79 21.46,29.85 v1(23.49,29.85)
COMMAND_4: length 104
  Top Layer w0.254: v1(18.16,30.1) 19.96,30.1 LED24.1
  Inner2 w0.254: v1(18.16,30.1) 18.16,33.02 18.15,33.03 21.78,36.65 32.83,36.65 34.22,38.04 34.22,42.35 30.84,45.73 30.84,48.87 30.56,49.15 30.56,80 42.9,80 44.49,81.59 50.09,81.59 51.81,83.31 58.8,83.31 59.18,83.69 59.18,85.85 H1.44
COMMAND_5: length 100.5
  Top Layer w0.254: v1(16.26,30.23) 16.26,30.15 LED23.1
  Inner2 w0.254: H1.42 56.64,85.85 56.39,85.85 56.32,85.92 52.26,85.92 51.84,85.5 51.56,85.5 51.56,83.57 49.94,81.94 44.34,81.94 42.75,80.36 30.36,80.36 30.2,80.2 30.2,49 30.48,48.72 30.48,45.58 33.86,42.21 33.86,38.19 32.68,37.01 21.63,37.01 16.26,31.63 v1(16.26,30.23)
COMMAND_CODE_0: length 196.7
  Top Layer w0.254: LED22.1 15.88,28.73 v1(15.88,28.96)
  Inner1 w0.254: H1.40 56.48,86.02 64.6,86.02 64.61,85.98 64.64,85.98 64.89,85.73 66.42,85.73 66.8,85.34 66.8,83.69 65.45,82.35 54.91,82.35 52.76,80.2 52.76,72.47 44.26,72.47 42.16,70.37 42.16,69.32 42.93,68.56 64.79,68.56 66.42,66.93 67.69,66.93 68.71,65.91 68.71,48.39 68.07,47.75 41.66,47.75 40.98,48.43 40.98,53.17 34.49,59.66 10.26,59.66 10.26,35.09 12.97,32.39 13.97,32.39 15.11,31.24 15.11,29.72 v1(15.88,28.96)
COMMAND_CODE_1: length 97.3
  Top Layer w0.254: LED21.1 13.2,29.72 v1(14.48,29.72)
  Inner2 w0.254: H1.38 52.83,87 51.69,85.85 49.4,85.85 49.15,85.6 49.15,83.95 47.5,82.3 44.19,82.3 42.6,80.71 30.21,80.71 29.85,80.35 29.85,48.85 30.13,48.57 30.13,45.43 33.5,42.06 33.5,38.33 32.53,37.36 21.48,37.36 15.11,30.99 15.11,30.35 v1(14.48,29.72)
COMMAND_CODE_2: length 99.3
  Top Layer w0.254: LED20.1 7.67,30.15 8.13,30.61 14.22,30.61 v1(14.48,30.86)
  Inner2 w0.254: H1.36 49.4,86.23 48.89,86.23 48.51,85.85 47.12,85.85 46.35,85.09 46.35,83.31 44.7,83.31 42.46,81.07 30.06,81.07 29.49,80.5 29.49,48.7 29.77,48.42 29.77,45.29 33.15,41.91 33.15,38.48 32.38,37.72 21.34,37.72 v1(14.48,30.86)
COMMAND_R14: length 1.5
  Top Layer w0.254: v1(42.42,14.48) 41.65,13.71 LED92.1
COMMAND_R15: length 1.4
  Top Layer w0.254: LED93.1 45.08,13.71 v1(45.97,14.61)
COMMAND_R16: length 127.9
  Top Layer w0.254: LED94.1 48.7,14.17 v1(48.26,14.61)
  Inner2 w0.254: H1.10 17.27,86.49 16.45,85.66 11.37,85.66 11.05,85.34 11.05,83.57 11.87,82.74 14.8,82.74 15.42,82.12 20.77,82.12 21.86,81.02 23.9,81.02 24.1,80.83 24.1,50 21.59,47.5 20.7,47.5 18.9,45.7 15.73,45.7 12.07,42.04 11.3,42.04 10.16,40.89 10.16,39.5 13.33,36.32 13.33,29.85 14.99,28.19 36.83,28.19 46.61,18.42 46.61,16.26 v1(48.26,14.61)
COMMAND_R17: length 134.7
  Top Layer w0.254: v1(51.82,14.73) 51.82,14.5 LED95.1
  Inner2 w0.254: H1.8 13.63,86.02 11.22,86.02 10.86,85.66 8.95,85.66 8.38,85.09 8.38,83.82 9.81,82.39 14.65,82.39 15.27,81.76 20.62,81.76 21.72,80.67 23.74,80.67 23.74,50.15 21.44,47.85 20.55,47.85 18.75,46.05 15.58,46.05 11.92,42.39 11.16,42.39 9.8,41.04 9.8,39.35 12.98,36.17 12.98,29.7 14.84,27.84 36.68,27.84 46.25,18.27 46.25,16.11 47.62,14.74 47.62,13.97 51.05,13.97 v1(51.82,14.73)
COMMAND_R18: length 138.3
  Top Layer w0.254: v1(55.37,14.73) 56.29,13.82 LED96.1
  Inner2 w0.254: v1(55.37,14.73) 54.25,13.61 47.27,13.61 47.27,14.59 45.9,15.96 45.9,18.12 36.53,27.48 14.69,27.48 12.62,29.55 12.62,36.03 9.45,39.2 9.45,41.19 11.01,42.75 11.77,42.75 15.43,46.41 18.6,46.41 20.41,48.21 21.3,48.21 23.38,50.3 23.38,74.15 16.13,81.41 15.13,81.41 14.5,82.03 9.67,82.03 8.77,82.93 6.35,82.93 5.71,83.57 5.71,85.6 5.97,85.85 8.51,85.85 8.67,86.02 10.72,86.02 11.07,86.37 11.44,86.37 H1.6
COMMAND_REG0: length 76.6
  Top Layer w0.254: v1(34.8,17.91) 34.8,17.59 LED38.1
  Bottom Layer w0.254: v1(34.8,17.91) 34.8,46.61 44.58,56.39 44.58,81.41 46.35,83.19 46.35,85.09 47.75,86.49 H1.34
COMMAND_REG1: length 78.3
  Top Layer w0.254: LED37.1 31.02,16.29 v1(32.89,18.16)
  Bottom Layer w0.254: v1(32.89,18.16) 33.15,18.16 34.44,19.46 34.44,46.76 44.22,56.54 44.22,81.13 43.81,81.53 43.81,85.73 H1.32
COMMAND_REG2: length 82.1
  Top Layer w0.254: LED36.1 27.55,17.65 v1(30.73,17.65)
  Bottom Layer w0.254: v1(30.73,17.65) 32.26,19.18 33.15,19.18 34.09,20.12 34.09,46.9 43.86,56.68 43.86,80.98 41.4,83.44 41.4,85.47 42.04,86.11 42.04,86.49 H1.30
COMMAND_REG3: length 87.2
  Top Layer w0.254: LED35.1 23.78,17.53 26.92,17.53 27.4,18.01 29.19,18.01 v1(29.72,18.54)
  Bottom Layer w0.254: H1.28 38.99,85.98 38.99,83.31 41.03,83.31 43.51,80.83 43.51,56.83 33.73,47.05 33.73,20.26 33,19.53 32.11,19.53 31.12,18.54 v1(29.72,18.54)
COMMAND_REG4: length 92.8
  Top Layer w0.254: v1(29.72,19.43) 29.59,19.43 29.21,19.05 27.08,19.05 25.91,17.88 23.63,17.88 23.28,17.53 19.92,17.53 LED39.1
  Bottom Layer w0.254: v1(29.72,19.43) 30.1,19.05 31.12,19.05 31.96,19.89 32.77,19.89 33.37,20.5 33.37,47.2 43.15,56.98 43.15,80.69 40.88,82.96 37.44,82.96 36.32,84.07 36.32,85.73 37.59,87 H1.26
COMMAND_REG5: length 97.6
  Top Layer w0.254: LED34.1 16.1,17.53 19.41,17.53 19.77,17.88 23.13,17.88 23.48,18.24 25.02,18.24 26.34,19.56 28.19,19.56 28.7,20.07 v1(28.96,20.07)
  Bottom Layer w0.254: H1.24 33.78,85.85 33.78,83.95 34.54,83.19 36.71,83.19 37.29,82.6 40.73,82.6 42.8,80.54 42.8,58.67 41.66,57.53 41.66,55.98 33.02,47.35 33.02,21.45 31.64,20.07 v1(28.96,20.07)
COMMAND_REG6: length 104.9
  Top Layer w0.254: v1(28.32,20.96) 27.23,20.96 24.87,18.59 23.34,18.59 22.98,18.24 19.62,18.24 19.27,17.88 15.95,17.88 15.72,17.65 12.62,17.65 LED33.1
  Bottom Layer w0.254: H1.22 31.24,85.85 31.24,83.57 31.98,82.83 36.56,82.83 37.14,82.24 40.59,82.24 42.44,80.39 42.44,66.83 41.28,65.66 41.28,65.02 42.44,63.86 42.44,58.82 41.3,57.68 41.3,56.13 32.66,47.49 32.66,40.41 31.62,39.37 31.62,38.48 32.66,37.44 32.66,21.6 32.02,20.96 v1(28.32,20.96)
COMMAND_REG7: length 110.6
  Top Layer w0.254: LED32.1 8.51,17.15 11.6,17.15 12.47,18.01 15.57,18.01 15.8,18.24 19.12,18.24 19.47,18.59 22.83,18.59 23.19,18.95 24.72,18.95 27.62,21.84 v1(28.07,21.84)
  Bottom Layer w0.254: v1(28.07,21.84) 28.83,21.84 29.36,21.31 31.87,21.31 32.31,21.74 32.31,37.29 31.27,38.33 31.27,39.52 32.31,40.56 32.31,47.64 40.94,56.28 40.94,57.83 42.09,58.97 42.09,63.71 40.92,64.88 40.92,65.81 42.09,66.97 42.09,80.24 40.44,81.89 37,81.89 36.41,82.48 29.92,82.48 28.7,83.69 28.7,86.11 29.72,87.12 H1.20
COUNTER_0: length 29.9
  Top Layer w0.254: H1.18 28.45,86.11 28.45,85.98 28.83,85.6 28.83,83.76 29.08,83.5 44.67,83.5 45.82,82.35 49.09,82.35 49.27,82.17 52.36,82.17 LED43.1
COUNTER_1: length 29.1
  Top Layer w0.254: H1.16 25.91,86.11 25.91,85.6 26.16,85.34 26.16,83.4 26.42,83.15 44.52,83.15 45.67,81.99 48.94,81.99 49.4,81.53 49.4,81.44 LED42.1
COUNTER_2: length 28.4
  Top Layer w0.254: H1.14 23.11,86.36 23.49,86.36 23.49,83.05 23.75,82.79 44.37,82.79 LED41.1
COUNTER_3: length 27.2
  Top Layer w0.254: H1.12 19.81,87 21.08,85.73 21.08,82.69 21.34,82.44 41.09,82.44 LED40.1
D17: length 61.9
  Top Layer w0.254: LED70.1 10.29,40.39 v1(10.92,40.39)
  Inner2 w0.254: H1.17 26.64,83.8 26.64,47.52 26.92,47.24 26.92,45.72 26.54,45.34 15.88,45.34 v1(10.92,40.39)
D19: length 55.3
  Top Layer w0.254: v1(20.57,46.48) 19.8,45.7 SW32.3 19.8,42.97 R23.2
  Inner2 w0.254: H1.5 13.46,83.31 14.73,83.31 15.57,82.48 20.92,82.48 22.01,81.38 24.05,81.38 24.45,80.98 24.45,49.08 22.72,47.35 22.08,47.35 21.72,46.99 21.08,46.99 v1(20.57,46.48)
E13: length 105.5
  Top Layer w0.254: LED61.1 v1(42.16,48.64)
  Inner1 w0.254: v1(16.13,14.35) 15.55,13.78 13.27,13.78 13.27,31.33 8.97,35.63 8.97,35.96 8.89,36.03 8.89,56.95 8.82,57.02 8.82,59.37 9.49,60.04 34.56,60.04 34.59,60.01 35.34,60.01 37.77,57.58 37.77,56.88 41.13,53.52 42.16,53.52 v1(42.16,48.64)
  Inner2 w0.254: H2.51 16.13,7.59 v1(16.13,14.35)
F18: length 61.1
  Top Layer w0.254: v1(11.81,40.01) 11.81,38.31 LED71.1
  Inner2 w0.254: H1.19 27,81.61 27,47.67 27.28,47.39 27.28,45.57 26.69,44.98 16.02,44.98 13.08,42.04 13.08,41.28 v1(11.81,40.01)
F19: length 35.9
  Top Layer w0.254: LED10.1 38.35,69.14 v1(38.35,69.6)
  Inner1 w0.254: v1(38.35,69.6) 38.73,69.98 39.25,69.98 43.16,73.89 51.33,73.89 51.33,81.05 52.83,82.55 H1.37
G15: length 152.2
  Top Layer w0.254: LED64.1 53.6,48.63 v1(53.59,48.64)
  Inner1 w0.254: 7.75,52.84 7.75,61.1 35,61.1 35.03,61.08 35.78,61.08 38.84,58.03 38.84,57.32 41.57,54.58 52.48,54.58 53.59,53.47 v1(53.59,48.64) ; 7.75,52.84 7.8,52.8 ; 7.75,52.84 7.8,52.81 7.8,52.8 ; v1(35.18,13.46) 35.18,13.28 35.1,13.21 31.01,13.21 30.51,12.71 12.2,12.71 12.2,30.89 7.83,35.25 7.8,35.25 7.8,52.8
  Inner2 w0.254: H2.45 19.94,4.19 20.7,4.95 23.15,4.95 23.74,5.55 25.78,5.55 27.29,7.06 34.44,7.06 34.44,12.95 34.95,13.46 v1(35.18,13.46)
G16: length 119.3
  Top Layer w0.254: v1(49.28,48.64) 49.36,48.56 LED63.1
  Inner1 w0.254: v1(20.45,13.46) 20.05,13.06 12.56,13.06 12.56,31.04 8.25,35.34 8.25,35.66 8.16,35.76 8.16,53.01 8.11,52.99 8.11,60.75 34.86,60.75 34.88,60.72 35.63,60.72 38.48,57.88 38.48,57.17 41.43,54.23 48.64,54.23 49.28,53.59 v1(49.28,48.64)
  Inner2 w0.254: H2.47 20.45,6.83 v1(20.45,13.46)
G18: length 112.5
  Top Layer w0.254: v1(45.85,48.51) 45.81,48.48 LED62.1
  Inner1 w0.254: v1(17.27,14.22) 17.53,13.97 17.53,13.93 17.02,13.42 12.91,13.42 12.91,31.18 8.61,35.49 8.61,35.81 8.51,35.91 8.51,53.36 8.46,53.4 ; 8.46,53.4 8.46,60.39 34.71,60.39 34.73,60.37 35.49,60.37 38.12,57.73 38.12,57.03 41.28,53.87 45.44,53.87 45.85,53.47 v1(45.85,48.51) ; 8.46,53.4 8.46,53.19
  Inner2 w0.254: v1(17.27,14.22) 17.27,6.2 H2.49
G21: length 52.3
  Top Layer w0.254: R24.2 21.07,42.59 SW32.4 21.07,45.83 v1(21.59,46.36)
  Inner2 w0.254: H1.7 15.24,84.58 16.99,82.83 21.06,82.83 22.16,81.74 24.2,81.74 24.86,81.07 24.86,48.99 22.86,46.99 22.22,46.99 v1(21.59,46.36)
H13: length 159.8
  Top Layer w0.254: LED66.1 v1(60.44,48.77)
  Inner1 w0.254: 7.04,52.5 7.04,52.52 ; 7.04,52.52 7.09,52.47 7.09,34.48 7.61,34.48 11.49,30.59 11.49,12 30.8,12 31.3,12.5 35.78,12.5 35.82,12.55 36.7,12.55 ; 7.04,52.52 7.04,61.82 35.3,61.82 35.32,61.79 36.08,61.79 39.4,58.46 39.55,58.46 39.55,57.62 41.87,55.3 58.62,55.3 60.44,53.47 v1(60.44,48.77) ; v1(36.96,12.83) 36.7,12.57
  Inner2 w0.254: v1(36.96,12.83) 36.58,12.83 35.43,11.68 35.43,6.73 35.05,6.35 27.59,6.35 H2.41
H17: length 164.5
  Top Layer w0.254: v1(64.26,48.77) 64.22,48.72 LED67.1
  Inner1 w0.254: 29.82,11.64 11.13,11.64 11.13,30.45 7.46,34.12 6.75,34.12 6.73,34.14 6.73,52.32 6.68,52.37 6.68,62.17 35.45,62.17 35.47,62.15 36.22,62.15 39.55,58.82 39.9,58.82 39.9,57.76 42.02,55.65 62.46,55.65 64.26,53.85 v1(64.26,48.77) ; 29.82,11.64 30.1,11.64 ; 29.82,11.64 30.95,11.64 31.42,12.12 35.89,12.12 35.97,12.19 v1(37.85,12.19)
  Inner2 w0.254: v1(37.85,12.19) 37.85,11.88 36.7,10.73 36.7,6.99 35.28,5.56 28.93,5.56 27.56,4.19 H2.39
H20: length 65.8
  Top Layer w0.254: LED73.1 17.57,38.86 v1(17.53,38.86)
  Inner2 w0.254: H1.23 35.05,84.46 33.55,82.96 29.35,82.96 27.71,81.32 27.71,47.97 27.99,47.69 27.99,45.28 26.99,44.27 16.32,44.27 14.96,42.91 14.96,41.17 17.27,38.86 v1(17.53,38.86)
H22: length 49.9
  Top Layer w0.254: R25.2 22.67,44.11 SW32.5 22.34,45.96 v1(22.73,46.36)
  Inner2 w0.254: H1.9 18.67,83.19 21.21,83.19 22.31,82.09 24.34,82.09 25.22,81.21 25.22,48.2 24.13,47.12 23.49,47.12 v1(22.73,46.36)
J14: length 156
  Top Layer w0.254: v1(57.02,48.51) 57.02,47.4 LED65.1
  Inner1 w0.254: v1(35.94,13.21) 35.94,13.17 35.62,12.85 31.15,12.85 30.65,12.35 11.84,12.35 11.84,30.74 7.75,34.83 7.64,34.83 7.44,35.02 7.44,52.62 7.39,52.65 7.39,61.46 35.15,61.46 35.18,61.44 35.93,61.44 39.19,58.17 39.19,57.47 41.72,54.94 55.93,54.94 57.02,53.85 v1(57.02,48.51)
  Inner2 w0.254: H2.43 23.89,5.19 25.92,5.19 27.44,6.71 34.8,6.71 34.8,12.57 35.31,12.57 v1(35.94,13.21)
J16: length 86.5
  Top Layer w0.254: R3.2 12.25,69.42 SW1.1 12.25,75.51 10.03,77.72 10.03,78.65 10.88,79.5 39.5,79.5 41.05,77.96 41.05,74.27 41.64,73.69 46.26,73.69 46.38,73.8 51.71,73.8 51.98,74.07 54.91,74.07 55.57,74.73 60.32,74.73 60.68,75.09 65.72,75.09 66.08,75.44 70.24,75.44 73.15,78.36 H1.53
J19: length 35
  Top Layer w0.254: LED11.1 39.88,66.92 v1(39.88,69.6)
  Inner1 w0.254: v1(39.88,69.6) 43.81,73.53 51.69,73.53 51.69,80.9 H1.39
J20: length 71.2
  Top Layer w0.254: LED74.1 21.23,38.99 v1(20.19,38.99)
  Inner2 w0.254: H1.25 35.5,82.49 29.39,82.49 28.07,81.17 28.07,48.11 28.35,47.83 28.35,45.13 27.13,43.92 16.46,43.92 15.32,42.77 15.32,41.32 17.01,39.62 19.56,39.62 v1(20.19,38.99)
K14: length 81.9
  Top Layer w0.254: H1.55 74.42,85.85 72.77,85.85 71.88,84.96 71.88,83.46 72.8,82.55 72.8,78.51 70.09,75.8 65.93,75.8 65.57,75.44 60.53,75.44 60.18,75.09 58.64,75.09 58.11,75.62 45.78,75.62 45.59,75.44 45.34,75.69 42.04,75.69 41.4,76.33 41.4,78.11 39.65,79.86 10.74,79.86 LED1.1
K17: length 59.5
  Top Layer w0.254: LED7.1 17.76,63.5 21.1,63.5 21.71,64.11 24.89,64.11 25.12,64.34 26.63,64.34 26.88,64.59 28.68,64.59 28.91,64.82 31.45,64.82 32.89,66.26 v1(32.89,68.96)
  Inner1 w0.254: H1.43 59.18,83.31 57.27,83.31 56.66,82.7 54.76,82.7 52.4,80.35 52.4,72.82 44.11,72.82 41,69.71 41,69.25 40.36,68.61 39.52,68.61 39.47,68.56 38.12,68.56 38.1,68.58 33.66,68.58 33.27,68.96 v1(32.89,68.96)
K19: length 52.5
  Top Layer w0.254: LED6.1 21.85,63.75 25.03,63.75 25.26,63.98 26.78,63.98 27.03,64.24 28.82,64.24 29.05,64.47 31.6,64.47 34.29,67.15 v1(34.29,69.22)
  Inner1 w0.254: H1.41 57.91,84.46 56.51,83.06 54.61,83.06 52.04,80.49 52.04,73.18 43.96,73.18 40.64,69.85 40.64,69.39 40.21,68.96 34.54,68.96 v1(34.29,69.22)
K21: length 47.5
  Top Layer w0.254: R26.2 23.61,43.02 SW32.6 23.88,44.72 v1(23.88,46.36)
  Inner2 w0.254: H1.11 20.32,84.58 22.45,82.45 24.49,82.45 25.58,81.36 25.58,47.55 25.15,47.12 24.64,47.12 v1(23.88,46.36)
L14: length 95.2
  Top Layer w0.254: v1(9.52,81.15) 9.52,80.66 7.96,79.1 6.59,79.1 5.41,77.91 5.41,69.28 5.71,68.97 5.71,60.36 SW31.5 5.46,57.5 5.46,54.99 5.8,54.65 R6.2 ; H1.45 62.99,82.42 v1(61.59,81.03)
  Inner1 w0.254: v1(61.72,81.03) v1(61.59,81.03) ; v1(39.62,77.09) 39.62,79.4 36.19,82.83 12.6,82.83 11.43,81.66 11.43,81.28 10.92,80.77 9.91,80.77 v1(9.52,81.15)
  Inner2 w0.254: v1(61.72,81.03) 61.22,81.53 52.55,81.53 50.83,79.81 45.22,79.81 43.64,78.22 42.66,78.22 41.53,77.09 v1(39.62,77.09)
L16: length 39.2
  Top Layer w0.254: v1(36.7,69.6) 36.7,67.99 32.47,63.75 29.35,63.75 LED9.1
  Inner1 w0.254: H1.35 50.98,83.9 50.98,74.42 50.8,74.25 43.01,74.25 39.15,70.38 38.12,70.38 37.62,69.88 36.98,69.88 v1(36.7,69.6)
L19: length 43.8
  Top Layer w0.254: v1(35.69,70.23) 35.56,70.1 35.56,67.92 31.75,64.11 29.2,64.11 28.97,63.88 27.18,63.88 26.92,63.63 25.41,63.63 LED8.1
  Inner1 w0.254: v1(35.69,70.23) 37.47,70.23 37.98,70.74 39,70.74 42.87,74.6 50.62,74.6 50.62,81.71 H1.33
L21: length 45
  Top Layer w0.254: R27.2 25.88,42.35 25.35,42.88 25.35,43.97 SW32.7 24.88,46.21 v1(25.02,46.36)
  Inner2 w0.254: H1.13 24.13,82.8 24.64,82.8 25.93,81.51 25.93,47.12 25.78,47.12 v1(25.02,46.36)
M13: length 180.3
  Top Layer w0.254: R22.2 18.53,43.29 SW32.2 18.53,47.26 v1(18.41,47.37)
  Inner1 w0.254: v1(18.41,47.37) 17.65,48.13 16.89,48.13 10.98,54.04 10.98,58.94 34.19,58.94 40.26,52.87 40.26,48.14 41.36,47.04 68.37,47.04 69.42,48.09 69.42,66.21 67.99,67.64 66.71,67.64 65.09,69.27 43.22,69.27 43.22,70.42 44.55,71.75 53.47,71.75 53.47,79.9 55.12,81.56 59.82,81.56 60.86,80.52 61.21,80.52 61.47,80.26 62.86,80.26 64.16,81.56 67.58,81.56 69.02,83 73.6,83 74.42,83.82 74.42,85.85 H1.56
M15: length 107.7
  Top Layer w0.254: 19.46,66.83 19.43,66.8 ; 19.46,66.83 17.41,66.83 16.93,66.34 8.85,66.34 5.77,69.43 5.77,77.77 6.74,78.74 8.11,78.74 10.67,81.3 v1(10.67,81.41) ; 19.46,66.83 22.63,66.83 26.9,71.1 26.9,71.37 30.73,71.37 30.99,71.63 30.99,73.62 LED29.1
  Inner1 w0.254: H1.47 64.45,85.66 47.05,85.66 46.48,85.09 46.48,83.69 45.97,83.19 12.45,83.19 v1(10.67,81.41)
M18: length 62.2
  Top Layer w0.254: v1(14.6,39.12) 14.86,38.86 LED72.1
  Inner2 w0.254: v1(14.6,39.12) 14.6,43.06 16.17,44.63 26.84,44.63 27.64,45.43 27.64,47.54 27.36,47.82 27.36,81.46 29.21,83.31 31.62,83.31 32.51,84.2 H1.21
M22: length 43.5
  Top Layer w0.254: v1(26.29,46.36) 26.29,44.59 SW32.8 27.56,43.03 R28.2
  Inner2 w0.254: v1(26.29,46.36) 26.29,83.19 H1.15
N13: length 160.3
  Top Layer w0.254: LED46.1 45.97,64.1 v1(45.97,65.15)
  Inner1 w0.254: H2.17 55.5,3.94 53.49,5.94 7.77,5.94 5.44,8.28 5.44,28.09 5.1,28.42 4.34,28.42 0.78,31.98 0.78,65.18 3.47,67.87 37.81,67.87 37.83,67.84 38.58,67.84 41.91,64.52 45.34,64.52 v1(45.97,65.15)
N18: length 82.2
  Top Layer w0.254: LED76.1 28.48,39.12 v1(27.69,39.12)
  Inner2 w0.254: H1.29 42.67,83.95 40.51,81.78 29.69,81.78 28.78,80.87 28.78,48.41 29.06,48.13 29.06,44.84 27.43,43.2 16.76,43.2 16.03,42.47 16.03,41.62 17.31,40.34 19.85,40.34 20.21,39.98 21.36,39.98 21.46,39.88 26.92,39.88 v1(27.69,39.12)
N20: length 76.8
  Top Layer w0.254: LED75.1 24.8,39.12 v1(24.64,39.12)
  Inner2 w0.254: H1.27 40.13,84.07 38.2,82.14 29.54,82.14 28.42,81.02 28.42,48.26 28.7,47.98 28.7,44.98 27.28,43.56 16.61,43.56 15.67,42.62 15.67,41.47 17.16,39.98 19.71,39.98 20.06,39.62 21.21,39.62 21.72,39.12 v1(24.64,39.12)
P14: length 154.7
  Top Layer w0.254: v1(42.16,65.28) 42.16,64.13 LED45.1
  Inner1 w0.254: H2.19 51.15,5.59 7.62,5.59 5.08,8.13 5.08,27.94 4.95,28.07 4.19,28.07 0.43,31.83 0.43,65.32 3.33,68.22 37.95,68.22 37.98,68.2 39.24,68.2 v1(42.16,65.28)
R17: length 176.6
  Top Layer w0.254: v1(17.4,47.12) 17.26,46.97 SW32.1 17.26,43.7 R21.2
  Inner1 w0.254: H1.54 71.75,85.73 69.72,85.73 69.34,85.34 69.34,83.82 67.44,81.92 54.98,81.92 53.11,80.05 53.11,72.11 44.41,72.11 42.52,70.22 42.52,69.46 43.07,68.91 64.94,68.91 66.56,67.29 67.84,67.29 69.06,66.06 69.06,48.24 68.22,47.4 41.51,47.4 40.62,48.29 40.62,53.02 34.34,59.3 10.62,59.3 10.62,53.9 v1(17.4,47.12)
RAM_DATA0: length 87.4
  Top Layer w0.254: v1(32.38,38.74) 32.65,38.74 LED77.1
  Inner2 w0.254: H1.31 45.21,84.33 42.31,81.43 29.92,81.43 29.14,80.65 29.14,48.56 29.42,48.28 29.42,44.69 27.57,42.85 16.91,42.85 16.38,42.33 16.38,41.76 17.46,40.69 20,40.69 20.36,40.34 21.5,40.34 21.61,40.23 27.07,40.23 27.43,39.88 31.24,39.88 v1(32.38,38.74)
REG_A0: length 191.9
  Top Layer w0.254: LED44.1 67.82,64.09 v1(67.82,65.02)
  Inner1 w0.254: v1(67.82,65.02) 67.31,64.52 64.68,64.52 64.3,64.14 60.96,64.14 60.73,63.91 60.34,63.91 59.98,63.55 54.27,63.55 53.91,63.19 53.4,63.19 53.29,63.09 50.12,63.09 49.76,62.74 46.58,62.74 46.22,62.38 41.03,62.38 37.7,65.71 36.95,65.71 36.92,65.73 4.36,65.73 2.92,64.29 2.92,32.87 5.22,30.56 5.98,30.56 7.57,28.97 7.57,9.16 8.65,8.08 58.07,8.08 59.5,6.65 64.2,6.65 65.04,5.81 66.66,5.81 67.54,4.93 68.98,4.93 70.13,3.78 H2.5
REG_A4: length 170.9
  Top Layer w0.254: LED48.1 53.34,64.06 v1(53.34,65.15)
  Inner1 w0.254: H2.13 60.35,3.78 57.48,6.66 8.06,6.66 6.15,8.57 6.15,28.38 5.4,29.14 4.63,29.14 1.49,32.27 1.49,64.88 3.77,67.16 37.51,67.16 37.53,67.13 38.29,67.13 41.61,63.8 45.63,63.8 45.99,64.16 49.17,64.16 49.53,64.52 52.7,64.52 v1(53.34,65.15)
REG_A5: length 166.3
  Top Layer w0.254: v1(49.66,65.15) LED47.1
  Inner1 w0.254: 27.62,6.3 28.32,6.3 ; 27.62,6.3 55.52,6.3 H2.15 ; 27.62,6.3 7.91,6.3 5.79,8.42 5.79,28.24 5.25,28.78 4.49,28.78 1.14,32.13 1.14,65.03 3.62,67.51 37.66,67.51 37.68,67.49 38.44,67.49 41.76,64.16 45.49,64.16 45.84,64.52 49.02,64.52 v1(49.66,65.15)
$1N2814: length 2.1
  Top Layer w0.254: LED1.2 8.14,75.14 R4.2
$1N2853: length 2.4
  Top Layer w0.254: LED2.2 30.1,72.14 R5.2
$1N3278: length 2.2
  Top Layer w0.254: R7.2 16.74,58.18 LED7.2
$1N3330: length 2.5
  Top Layer w0.254: LED6.2 20.57,57.92 R8.2
$1N3426: length 2.6
  Top Layer w0.254: R9.2 24.26,57.79 LED8.2
$1N3572: length 2.5
  Top Layer w0.254: LED9.2 R10.2
$1N3668: length 2.5
  Top Layer w0.254: LED10.2 31.74,57.92 R11.2
$1N3764: length 2.5
  Top Layer w0.254: LED11.2 R12.2
$1N7060: length 2.3
  Top Layer w0.254: LED20.2 R32.2
$1N7156: length 2.5
  Top Layer w0.254: 11.27,25.68 R33.2
$1N7252: length 2.4
  Top Layer w0.254: R34.2 14.86,23.24 LED22.2
$1N7364: length 2.4
  Top Layer w0.254: R35.2 18.68,23.25 LED23.2
$1N7463: length 2.3
  Top Layer w0.254: R36.2 22.48,25.48 LED24.2
$1N7562: length 2.3
  Top Layer w0.254: LED25.2 26.16,23.16 26.16,23.16
$1N7661: length 2.4
  Top Layer w0.254: LED26.2 R38.2
$1N7760: length 2.5
  Top Layer w0.254: LED27.2 33.63,22.99 R39.2
$1N7859: length 2.7
  Top Layer w0.254: R40.2 37.31,22.88 LED28.2
$1N7982: length 2.4
  Top Layer w0.254: 33.93,72 33.93,74.43 LED29.2
$1N8372: length 2.4
  Top Layer w0.254: LED32.2 7.67,14.18 R44.2
$1N8471: length 2.5
  Top Layer w0.254: R45.2 11.25,11.69 LED33.2
$1N8570: length 2.5
  Top Layer w0.254: LED34.2 14.86,11.68 R46.2
$1N8666: length 2.6
  Top Layer w0.254: LED35.2 22.58,11.79 R47.2
$1N8762: length 2.5
  Top Layer w0.254: R48.2 26.19,11.7 LED36.2
$1N8858: length 2.5
  Top Layer w0.254: LED37.2 29.88,11.7 R49.2
$1N8954: length 2.6
  Top Layer w0.254: LED38.2 33.63,11.69 R50.2
$1N9036: length 2.5
  Top Layer w0.254: R42.2 18.68,11.69 LED39.2
$1N9132: length 2.4
  Top Layer w0.254: R51.2 42.6,76.56 LED40.2
$1N9231: length 2.5
  Top Layer w0.254: R52.2 46.23,76.32 LED41.2
$1N9330: length 2.5
  Top Layer w0.254: LED42.2 49.91,76.33 R53.2
$1N9429: length 2.5
  Top Layer w0.254: LED43.2 R54.2
$1N9531: length 2.2
  Top Layer w0.254: LED44.2 67.77,59.7
$1N9616: length 2.3
  Top Layer w0.254: R56.2 42.25,59.7 LED45.2
$1N9781: length 2.3
  Top Layer w0.254: LED46.2 45.94,59.69 R57.2
$1N9785: length 2.4
  Top Layer w0.254: R58.2 49.66,59.57 LED47.2
$1N10111: length 2.4
  Top Layer w0.254: R59.2 53.35,59.57 LED48.2
$1N10115: length 2.4
  Top Layer w0.254: LED49.2 R60.2
$1N10119: length 2.3
  Top Layer w0.254: R61.2 60.55,59.77 LED50.2
$1N10123: length 2.3
  Top Layer w0.254: LED51.2 R62.2
$1N10258: length 2.3
  Top Layer w0.254: R63.2 42.28,53.71 LED52.2
$1N10357: length 2.4
  Top Layer w0.254: LED53.2 45.99,51.33 R64.2
$1N10550: length 2.4
  Top Layer w0.254: LED54.2 49.69,51.33 R65.2
$1N10554: length 2.3
  Top Layer w0.254: R66.2 53.59,53.69 LED55.2
$1N10936: length 2.4
  Top Layer w0.254: LED56.2 R67.2
$1N10940: length 2.3
  Top Layer w0.254: R68.2 60.57,51.53 LED57.2
$1N10944: length 2.2
  Top Layer w0.254: LED58.2 R69.2
$1N10948: length 2.3
  Top Layer w0.254: LED59.2 R70.2
$1N11630: length 2.2
  Top Layer w0.254: 67.89,45.42 R71.2
$1N11634: length 2.3
  Top Layer w0.254: LED61.2 R72.2
$1N11638: length 2.3
  Top Layer w0.254: LED62.2 45.81,43.12 R73.2
$1N11642: length 2.3
  Top Layer w0.254: LED63.2 49.36,43.04 R74.2
$1N11646: length 2.4
  Top Layer w0.254: R75.2 53.6,42.92 LED64.2
$1N11650: length 2.4
  Top Layer w0.254: R76.2 57.02,42.92 LED65.2
